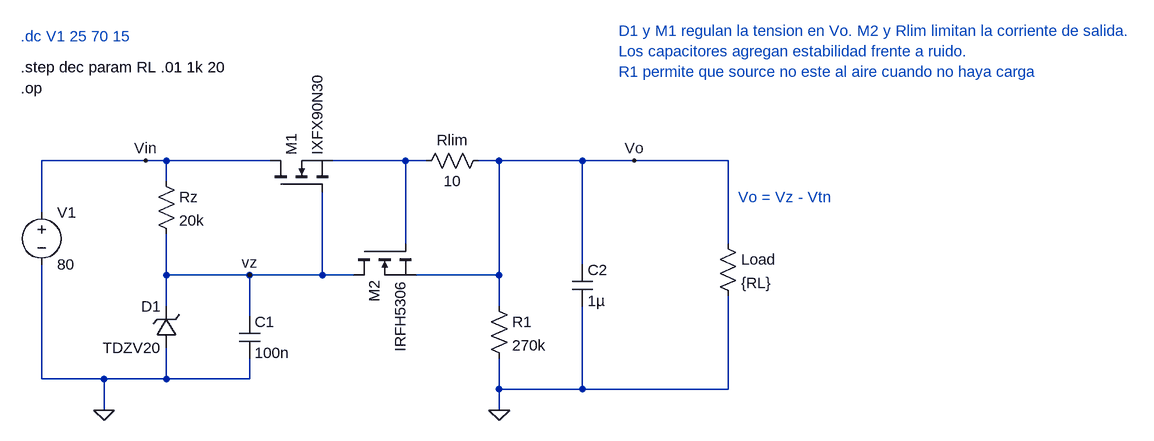
[diagram p0: schematic nMos_Ze_regulator_v1.asc]
nMos_Ze_regulator_v1.asc, the LTspice schematic file:
Version 4
SHEET 1 1620 680
WIRE 32 80 -128 80
WIRE 64 80 32 80
WIRE 224 80 64 80
WIRE 432 80 320 80
WIRE 464 80 432 80
WIRE 576 80 544 80
WIRE 704 80 576 80
WIRE 784 80 704 80
WIRE 928 80 784 80
WIRE 64 112 64 80
WIRE -128 160 -128 80
WIRE 432 208 432 80
WIRE 928 208 928 80
WIRE 704 240 704 80
WIRE 64 256 64 192
WIRE 192 256 64 256
WIRE 304 256 304 128
WIRE 304 256 192 256
WIRE 352 256 304 256
WIRE 576 256 576 80
WIRE 576 256 448 256
WIRE 64 304 64 256
WIRE 576 304 576 256
WIRE 192 320 192 256
WIRE -128 416 -128 240
WIRE -32 416 -128 416
WIRE 64 416 64 368
WIRE 64 416 -32 416
WIRE 192 416 192 384
WIRE 192 416 64 416
WIRE 576 432 576 384
WIRE 704 432 704 304
WIRE 704 432 576 432
WIRE 928 432 928 288
WIRE 928 432 704 432
WIRE -32 464 -32 416
WIRE 576 464 576 432
FLAG 32 80 Vin
FLAG 192 256 vz
FLAG -32 464 0
FLAG 576 464 0
FLAG 784 80 Vo
SYMBOL voltage -128 144 R0
WINDOW 123 0 0 Left 0
WINDOW 39 0 0 Left 0
SYMATTR InstName V1
SYMATTR Value 80
SYMBOL nmos 224 128 R270
SYMATTR InstName M1
SYMATTR Value IXFX90N30
SYMBOL res 48 96 R0
SYMATTR InstName Rz
SYMATTR Value 20k
SYMBOL zener 80 368 R180
WINDOW 0 24 64 Left 2
WINDOW 3 24 0 Left 2
SYMATTR InstName D1
SYMATTR Value TDZV20
SYMBOL nmos 352 208 M90
SYMATTR InstName M2
SYMATTR Value IRFH5306
SYMBOL res 560 64 R90
WINDOW 0 0 56 VBottom 2
WINDOW 3 32 56 VTop 2
SYMATTR InstName Rlim
SYMATTR Value 10
SYMBOL res 560 288 R0
SYMATTR InstName R1
SYMATTR Value 270k
SYMBOL cap 176 320 R0
SYMATTR InstName C1
SYMATTR Value 100n
SYMBOL cap 688 240 R0
SYMATTR InstName C2
SYMATTR Value 1µ
SYMBOL res 912 192 R0
SYMATTR InstName Load
SYMATTR Value {RL}
TEXT -160 -112 Left 2 ;.dc V1 25 70 15
TEXT -160 -64 Left 2 !.step dec param RL .01 1k 20
TEXT -160 -32 Left 2 !.op
TEXT 760 -120 Left 2 ;D1 y M1 regulan la tension en Vo. M2 y Rlim limitan la corriente de salida.\nLos capacitores agregan estabilidad frente a ruido.\nR1 permite que source no este al aire cuando no haya carga
TEXT 944 136 Left 2 ;Vo = Vz - Vtn

The netlist it stands for:
* nMos_Ze_regulator_v1.asc
V1 Vin 0 80
M1 Vin vz N001 N001 IXFX90N30
Rz Vin vz 20k
D1 0 vz TDZV20
M2 vz N001 Vo Vo IRFH5306
Rlim Vo N001 10
R1 Vo 0 270k
C1 vz 0 100n
C2 Vo 0 1µ
R§Load Vo 0 {RL}
.model D D
.lib standard.dio
.model NMOS NMOS
.model PMOS PMOS
.lib standard.mos
* .dc V1 25 70 15
.step dec param RL .01 1k 20
.op
* D1 y M1 regulan la tension en Vo. M2 y Rlim limitan la corriente de salida.
* Los capacitores agregan estabilidad frente a ruido.
* R1 permite que source no este al aire cuando no haya carga
* Vo = Vz - Vtn
.backanno
.end